# EAGLE design Arduino Nano-Rev3.2 (EAGLE 7.3.0)
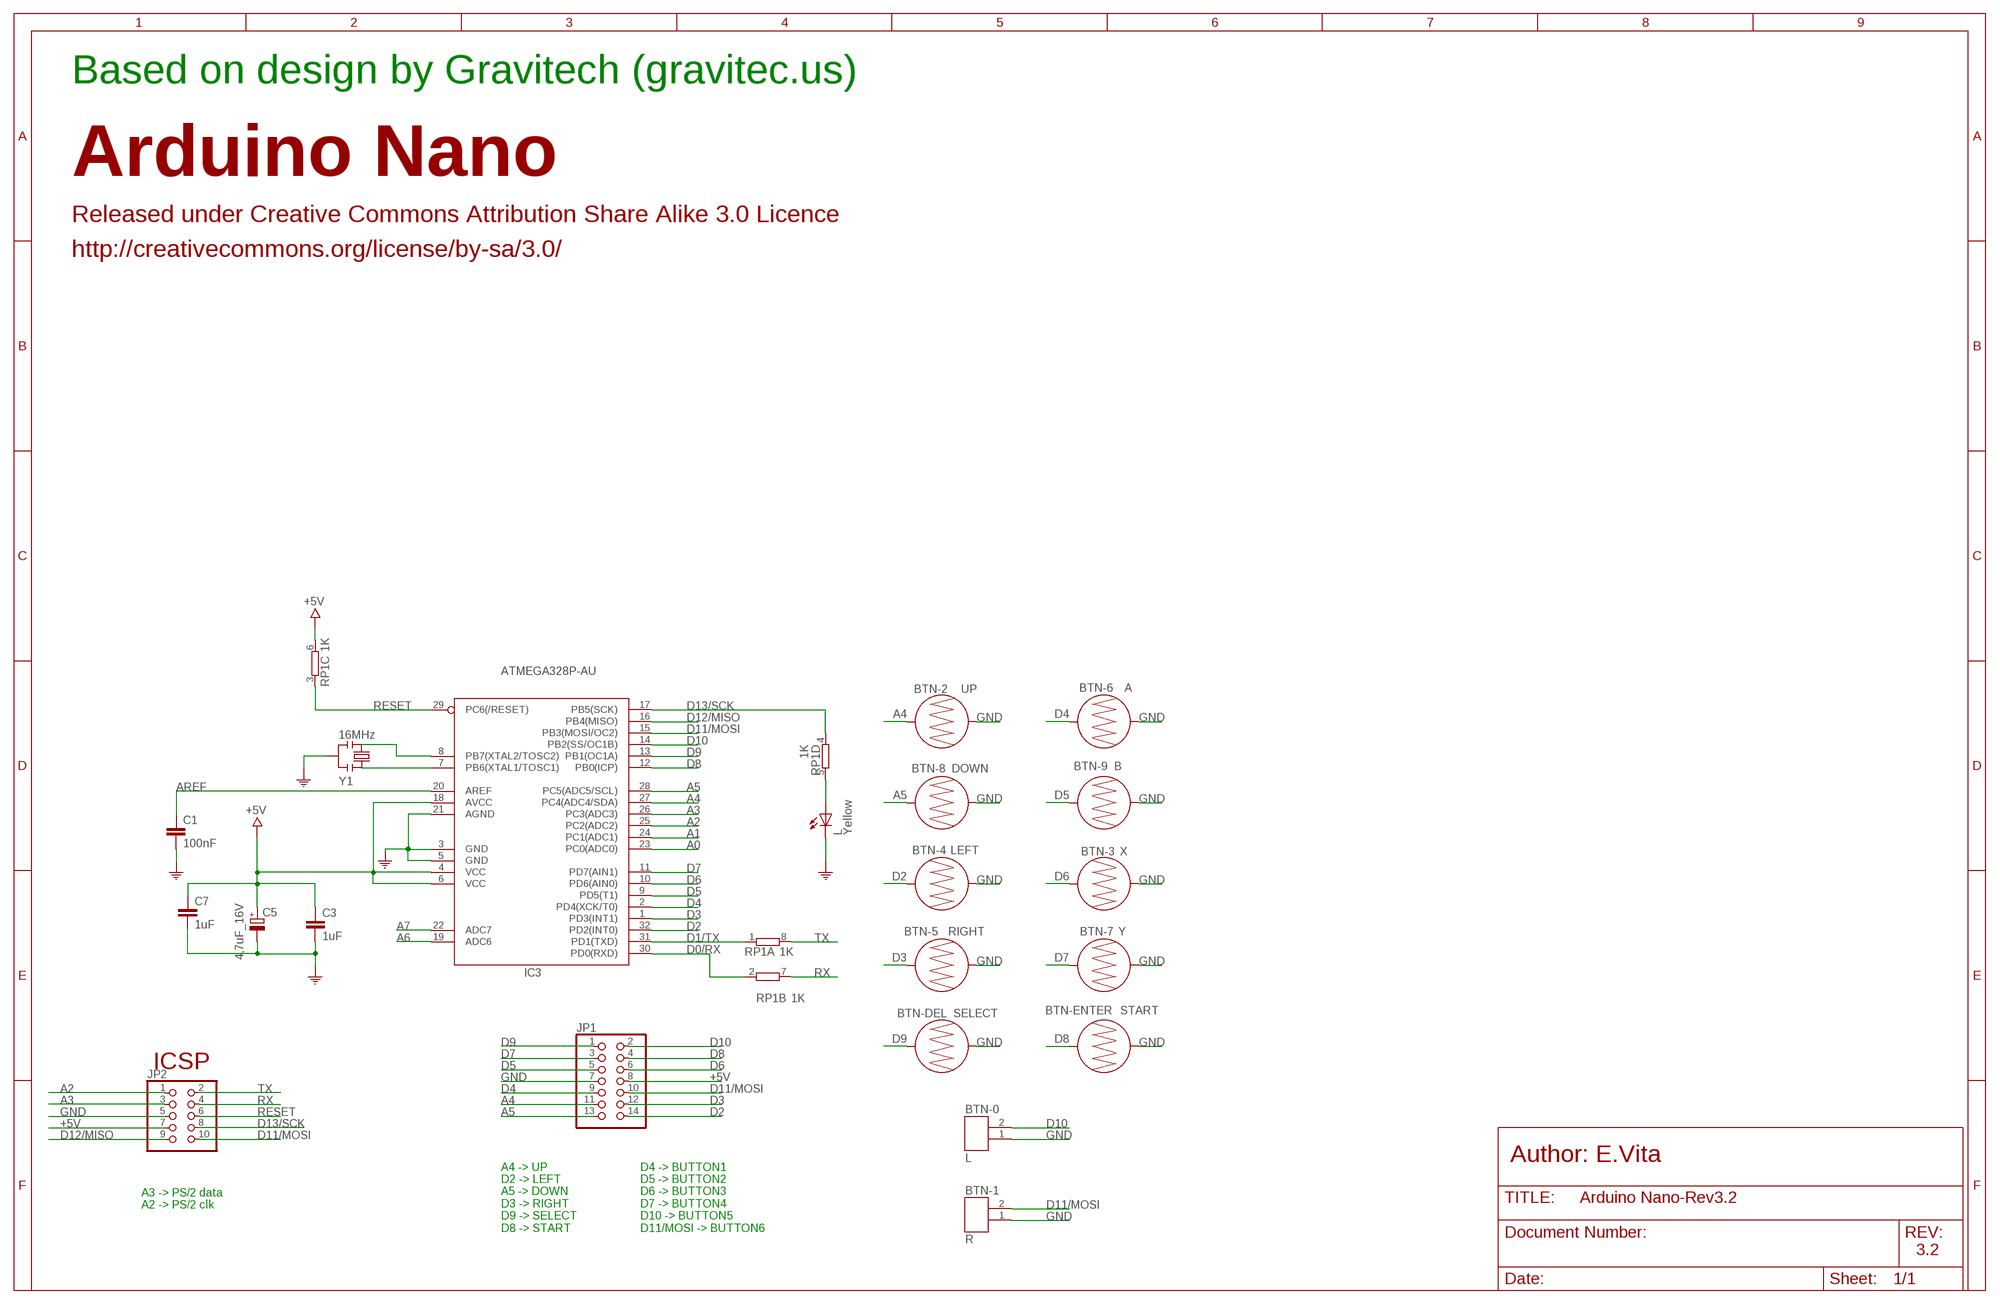
[diagram p0: schematic, sheet 1]

## Parts
BTN-0  L  1X02_SMD  [1X02_SMD]
BTN-1  R  1X02_SMD  [1X02_SMD]
BTN-2  UP  BUTTON-CONDUCTIVE-PAD  [BUTTON-CONDUCTIVE-PAD]
BTN-3  X  BUTTON-CONDUCTIVE-BUTTON  [BUTTON-CONDUCTIVE-BUTTON]
BTN-4  LEFT  BUTTON-CONDUCTIVE-PAD  [BUTTON-CONDUCTIVE-PAD]
BTN-5  RIGHT  BUTTON-CONDUCTIVE-PAD  [BUTTON-CONDUCTIVE-PAD]
BTN-6  A  BUTTON-CONDUCTIVE-BUTTON  [BUTTON-CONDUCTIVE-BUTTON]
BTN-7  Y  BUTTON-CONDUCTIVE-BUTTON  [BUTTON-CONDUCTIVE-BUTTON]
BTN-8  DOWN  BUTTON-CONDUCTIVE-PAD  [BUTTON-CONDUCTIVE-PAD]
BTN-9  B  BUTTON-CONDUCTIVE-BUTTON  [BUTTON-CONDUCTIVE-BUTTON]
BTN-DEL  SELECT  BUTTON-CONDUCTIVE-BUTTON  [BUTTON-CONDUCTIVE-BUTTON]
BTN-ENTER  START  BUTTON-CONDUCTIVE-BUTTON  [BUTTON-CONDUCTIVE-BUTTON]
C1  100nF  0015_100NF_0603  [C0603-ROUND]
C3  1uF  0006_1UF_0603/GRM188R61E105KA12D  [C0603-ROUND]
C5  4,7uF_16V  0833_TAJA475MO16RNJ  [TAN-A]
C7  1uF  0006_1UF_0603/GRM188R61E105KA12D  [C0603-ROUND]
IC3  ATMEGA328P-AU  0265_ATMEGA328P-AU  [TQFP32-08]
JP1  PINHD-2X7  [2X07]
JP2  PINHD-2X5  [2X05]
L  Yellow  0044_KPT-2012YC  [CHIPLED_0805]
RP1  1K  0005_064R_1K_/_CAY16-102J4LF  [CAY16]
Y1  16MHz  0011_CSTCE16M0V53-R0  [RESONATOR]

## Nets
+5V: C3.1 C5.1(+) C7.1 IC3.4(VCC) IC3.6(VCC) IC3.18(AVCC) JP1.8 JP2.7 RP1.6
A0: IC3.23(PC0(ADC0))
A1: IC3.24(PC1(ADC1))
A2: IC3.25(PC2(ADC2)) JP2.1
A3: IC3.26(PC3(ADC3)) JP2.3
A4: BTN-2.1 IC3.27(PC4(ADC4/SDA)) JP1.11
A5: BTN-8.1 IC3.28(PC5(ADC5/SCL)) JP1.13
A6: IC3.19(ADC6)
A7: IC3.22(ADC7)
AREF: C1.1 IC3.20(AREF)
D0/RX: IC3.30(PD0(RXD)) RP1.2
D1/TX: IC3.31(PD1(TXD)) RP1.1
D2: BTN-4.2 IC3.32(PD2(INT0)) JP1.14
D3: BTN-5.1 IC3.1(PD3(INT1)) JP1.12
D4: BTN-6.1 IC3.2(PD4(XCK/T0)) JP1.9
D5: BTN-9.1 IC3.9(PD5(T1)) JP1.5
D6: BTN-3.2 IC3.10(PD6(AIN0)) JP1.6
D7: BTN-7.1 IC3.11(PD7(AIN1)) JP1.3
D8: BTN-ENTER.2 IC3.12(PB0(ICP)) JP1.4
D9: BTN-DEL.1 IC3.13(PB1(OC1A)) JP1.1
D10: BTN-0.2 IC3.14(PB2(SS/OC1B)) JP1.2
D11/MOSI: BTN-1.2 IC3.15(PB3(MOSI/OC2)) JP1.10 JP2.10
D12/MISO: IC3.16(PB4(MISO)) JP2.9
D13/SCK: IC3.17(PB5(SCK)) JP2.8 RP1.4
GND: BTN-0.1 BTN-1.1 BTN-2.2 BTN-3.1 BTN-4.1 BTN-5.2 BTN-6.2 BTN-7.2 BTN-8.2 BTN-9.2 BTN-DEL.2 BTN-ENTER.1 C1.2 C3.2 C5.2(-) C7.2 IC3.3(GND) IC3.5(GND) IC3.21(AGND) JP1.7 JP2.5 L.C Y1.2 ; supply symbol labelled COM
N$1: IC3.8(PB7(XTAL2/TOSC2)) Y1.3
N$2: IC3.7(PB6(XTAL1/TOSC1)) Y1.1
N$7: L.A RP1.5
RESET: IC3.29(PC6(/RESET)) JP2.6 RP1.3
RX: JP2.4 RP1.7
TX: JP2.2 RP1.8

## Notes on the sheet
- Based on design by Gravitech (gravitec.us)
- Arduino Nano
- Released under Creative Commons Attribution Share Alike 3.0 Licence
- http://creativecommons.org/license/by-sa/3.0/
- ICSP
- Author: E.Vita
- A3 -> PS/2 data
  A2 -> PS/2 clk
- A4 -> UP
  D2 -> LEFT
  A5 -> DOWN
  D3 -> RIGHT
  D9 -> SELECT
  D8 -> START
- D4 -> BUTTON1
  D5 -> BUTTON2
  D6 -> BUTTON3
  D7 -> BUTTON4
  D10 -> BUTTON5
  D11/MOSI -> BUTTON6
- 3.2

## Library data of the parts
BTN-0 BTN-1 = ,giltesa:1X02_SMD
BTN-2 BTN-4 BTN-5 BTN-8 = ,giltesa:BUTTON-CONDUCTIVE-PAD
BTN-3 BTN-6 BTN-7 BTN-9 BTN-DEL BTN-ENTER = ,giltesa:BUTTON-CONDUCTIVE-BUTTON
C1 = Condensatori:0015_100NF_0603: 100nF 0603 50V; CASE: 0603; MONTHLY_USAGE: _____; PART_NUMBER: cl10b104kbnc; PRICE: _____; SUPPLIER: _____; TYPE: Condensatori
C3 C7 = Condensatori:0006_1UF_0603/GRM188R61E105KA12D: 1uF 0603; CASE: 0603; MONTHLY_USAGE: _____; PART_NUMBER: 1uF_0603/GRM188R61E105KA12D; PRICE: _____; SUPPLIER: _____; TYPE: Condensatori
C5 = Condensatori:0833_TAJA475MO16RNJ: 4,7uF; CASE: Case_A_(1206); MONTHLY_USAGE: _____; PART_NUMBER: TAJA475MO16RNJ; PRICE: _____; SUPPLIER: _____; TYPE: Condensatori
IC3 = IntegratedCircuits:0265_ATMEGA328P-AU: 8-bit Microcontroller with 32KBytes In-System Programmable Flash ATMEGA328P-AU; CASE: TQFP32_7x7; MONTHLY_USAGE: _____; PART_NUMBER: ATMEGA328P-AU; PRICE: _____; SUPPLIER: _____; TYPE: Circuito_Integrato
JP1 = pinhead:PINHD-2X7: PIN HEADER
JP2 = pinhead:PINHD-2X5: PIN HEADER
L = Opto:0044_KPT-2012YC: LED YELLOW - SMD - 0805; MONTHLY_USAGE: _____; PART_NUMBER: KPT-2012YC; PRICE: _____; SUPPLIER: _____; TYPE: Opto
RP1 = Resistenze:0005_064R_1K_/_CAY16-102J4LF: 1K 064R; CASE: SMD_3,2x1,6; MONTHLY_USAGE: _____; PART_NUMBER: 064R_1K_/_CAY16-102J4LF; PRICE: _____; SUPPLIER: _____; TYPE: Resistenze
Y1 = Cristalli:0011_CSTCE16M0V53-R0: 16Mhz - SMD; MONTHLY_USAGE: _____; PART_NUMBER: CSTCE16M0V53-R0; PRICE: _____; SUPPLIER: _____; TYPE: Cristalli; VALUE: CSTCE16M0V53-R0

## Board
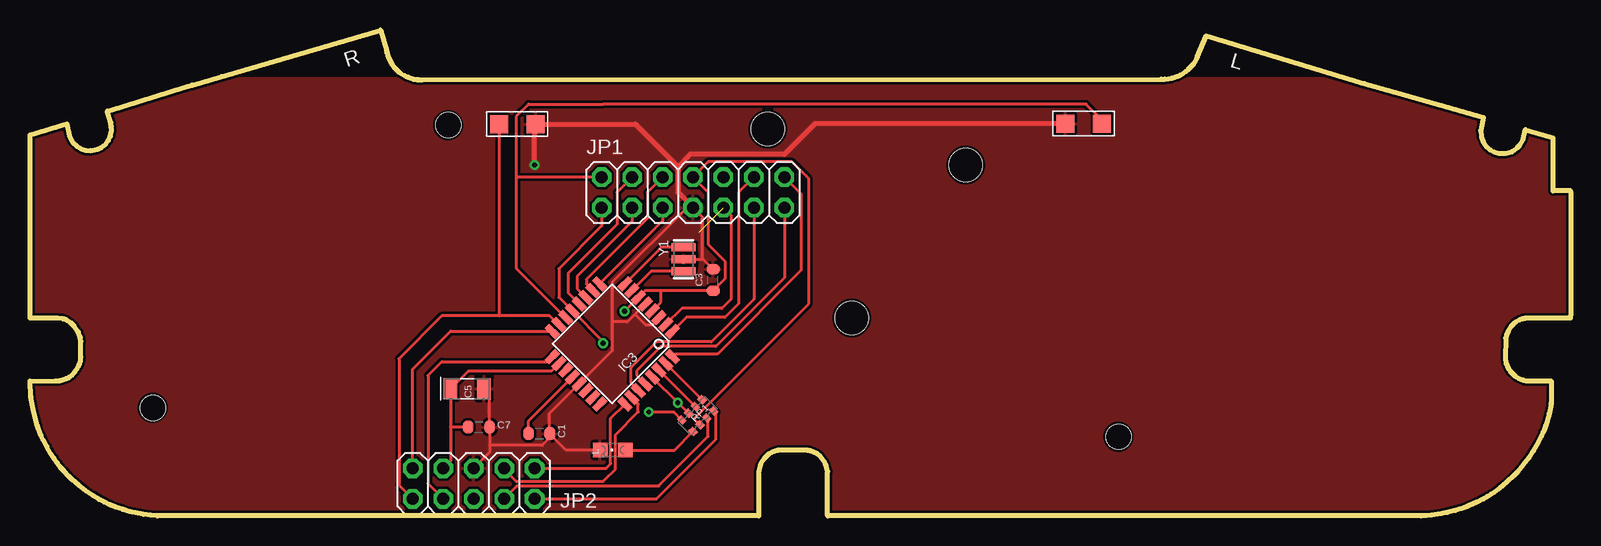
[diagram p1: board, top side]
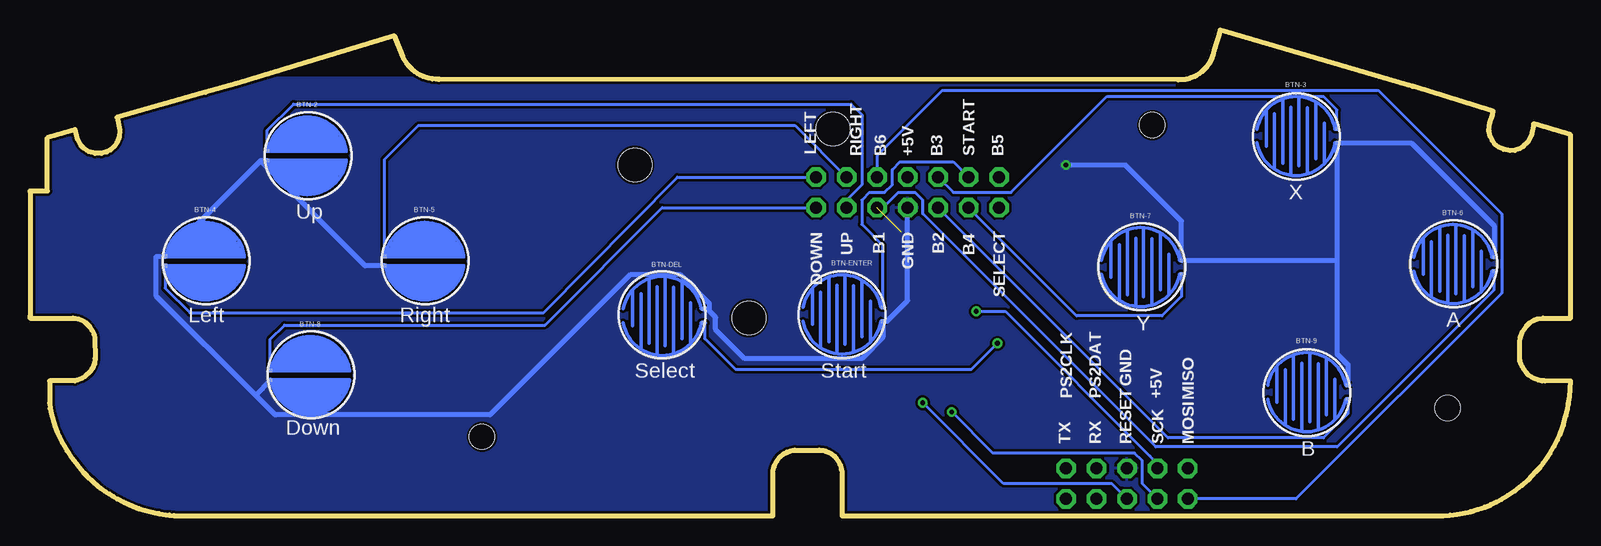
[diagram p2: board, bottom side, seen from below]

Size 128.42 x 40.49 mm. Coordinates in mm from the lower left corner, seen from the top.
Outline: 94.34,36.37 32.72,36.32 32.36,36.35 32.26,36.35 32.08,36.37 31.95,36.4 31.78,36.45 31.52,36.55 31.32,36.63 31.19,36.7 30.91,36.88 30.78,36.98 30.63,37.11 30.43,37.31 30.33,37.44 30.2,37.62 30.12,37.72 29.9,38.18 29.82,38.38 29.77,38.58 29.72,38.76 29.21,40.49 15.95,36.6 13.51,35.89 13.16,35.79 6.45,33.73 6.5,33.45 6.73,32.77 6.78,32.46 6.81,32.11 6.71,31.62 6.53,31.29 6.3,30.96 5.99,30.73 5.59,30.53 5.03,30.43 4.65,30.45 4.22,30.61 3.94,30.78 3.56,31.14 3.28,31.67 3.07,32.66 0,31.75 0,16.48 2.31,16.48 2.77,16.41 3.07,16.28 3.4,16.08 3.66,15.85 4.04,15.32 4.17,14.96 4.19,14.86 4.24,14.53 4.24,13.23 4.22,12.93 4.11,12.6 4.04,12.45 3.91,12.22 3.73,11.99 3.51,11.73 3.25,11.56 3,11.43 2.72,11.33 2.49,11.28 2.36,11.25 2.13,11.25 0,11.23 0.08,9.93 0.18,9.3 0.25,8.86 0.38,8.33 0.61,7.54 0.91,6.73 1.09,6.32 1.4,5.77 1.73,5.18 1.98,4.8 2.29,4.39 2.54,4.06 2.84,3.71 3.23,3.3 3.51,3.02 4.06,2.54 4.65,2.08 5.26,1.68 5.77,1.37 6.17,1.17 6.65,0.94 7.16,0.74 7.72,0.53 8.33,0.36 9.45,0.13 10.06,0.05 10.64,0 60.73,0 60.73,3.63 60.78,3.86 60.86,4.17 60.91,4.29 60.99,4.47 61.19,4.75 61.42,5 61.62,5.16 61.85,5.28 62.1,5.38 62.33,5.46 62.64,5.49 64.67,5.49 64.85,5.46 65.02,5.41 65.33,5.31 65.61,5.16 65.89,4.93 66.19,4.55 66.32,4.29 66.4,4.09 66.5,3.71 66.5,0 115.98,0 116.43,0.03 116.81,0.05 117.65,0.18 118.19,0.28 118.85,0.46 119.33,0.61 119.84,0.79 120.29,0.99 120.62,1.14 121.16,1.42 121.46,1.6 121.79,1.8 122.07,1.98 122.53,2.31 122.78,2.51 123.16,2.84 123.67,3.33 123.98,3.63 124.94,4.83 125.32,5.41 125.7,6.07 125.98,6.63 126.14,6.99 126.34,7.52 126.64,8.51 126.75,8.94 126.8,9.4 126.8,11.25 124.69,11.25 124.49,11.3 124.05,11.48 123.83,11.63 123.42,11.99 123.24,12.27 123.04,12.78 122.99,13.13 123.01,14.81 123.09,15.11 123.24,15.44 123.44,15.77 123.65,15.98 123.88,16.15 124.18,16.33 124.41,16.41 124.61,16.46 124.84,16.48 128.42,16.48
Outline: 94.28,36.4 94.59,36.4 94.87,36.42 95.17,36.47 95.45,36.55 95.66,36.63 95.89,36.73 96.14,36.88 96.37,37.03 96.57,37.21 96.75,37.36 96.9,37.54 97,37.67 97.26,38.07 97.33,38.25 98.04,40.01 111.25,36.02 113.82,35.28 121.16,33.2 120.93,32.13 120.98,31.57 121.16,31.14 121.41,30.76 121.72,30.51 122.02,30.33 122.45,30.2 122.99,30.2 123.55,30.35 123.98,30.66 124.18,30.89 124.46,31.37 124.66,32.18 126.97,31.5 126.97,27.08 128.42,27.08
Outline: 128.42,27.03 128.42,16.66
Copper layers (1*16): Top 0.035mm / dielectric 1.5mm / Bottom 0.035mm
Design rules "default *": minimum track width 10mil, minimum drill 16mil, track to track 8mil, track to pad 8mil, pad to pad 8mil, via to via 8mil, smd to smd 8mil, copper to edge 8mil, drill to drill 8mil, minimum pad ring 12mil, minimum via ring 8mil, stop-mask expansion 0mil, vias tented up to drill 24mil, thermal gap 10mil
Holes 2.8 mm at 61.5,32.24 78,29.24 68.5,16.49
Holes 2.1 mm at 10.25,8.99 90.75,6.59 34.87,32.57

### Footprints (pad centres in the part's own frame; a part is rotated, then mirrored left to right if it is on the bottom)
1X02_SMD = smd 1.5 x 1.5: 1 -1.48,0.02; 2 1.58,0.02
BUTTON-CONDUCTIVE-PAD = smd 0.305 x 0.305: 1 -3.334,0.396; 2 -3.334,-0.396
BUTTON-CONDUCTIVE-BUTTON = smd 0.305 x 0.305: 1 3.41,-0.577; 2 3.412,0.577
C0603-ROUND = smd 0.898 x 1.1: 1 -0.889,0; 2 0.889,0
TAN-A = smd 1.118 x 1.778: 1 0,0; 2 2.794,0
TQFP32-08 = smd 1.27 x 0.559: 1 -4.293,2.8; 2 -4.293,2; 3 -4.293,1.2; 4 -4.293,0.4; 5 -4.293,-0.4; 6 -4.293,-1.2; 7 -4.293,-2; 8 -4.293,-2.8; 17 4.293,-2.8; 18 4.293,-2; 19 4.293,-1.2; 20 4.293,-0.4; 21 4.293,0.4; 22 4.293,1.2; 23 4.293,2; 24 4.293,2.8 | smd 0.559 x 1.27: 9 -2.8,-4.293; 10 -2,-4.293; 11 -1.2,-4.293; 12 -0.4,-4.293; 13 0.4,-4.293; 14 1.2,-4.293; 15 2,-4.293; 16 2.8,-4.293; 25 2.8,4.293; 26 2,4.293; 27 1.2,4.293; 28 0.4,4.293; 29 -0.4,4.293; 30 -1.2,4.293; 31 -2,4.293; 32 -2.8,4.293
2X07 = drill 1.016 octagon: 1 -7.62,-1.27; 2 -7.62,1.27; 3 -5.08,-1.27; 4 -5.08,1.27; 5 -2.54,-1.27; 6 -2.54,1.27; 7 0,-1.27; 8 0,1.27; 9 2.54,-1.27; 10 2.54,1.27; 11 5.08,-1.27; 12 5.08,1.27; 13 7.62,-1.27; 14 7.62,1.27
2X05 = drill 1.016 octagon: 1 -5.08,-1.27; 2 -5.08,1.27; 3 -2.54,-1.27; 4 -2.54,1.27; 5 0,-1.27; 6 0,1.27; 7 2.54,-1.27; 8 2.54,1.27; 9 5.08,-1.27; 10 5.08,1.27
CHIPLED_0805 = smd 1.2 x 1.2: A 0,-1.05; C 0,1.05
CAY16 = smd 0.5 x 0.65: 1 -1.2,-0.675; 2 -0.4,-0.675; 3 0.4,-0.675; 4 1.2,-0.675; 5 1.2,0.675; 6 0.4,0.675; 7 -0.4,0.675; 8 -1.2,0.675
RESONATOR = smd 0.7 x 2: 1 -1,0; 2 0,0; 3 1,0

### Placement (x,y rotation side)
BTN-0  87.78,32.66 0 top
BTN-1  40.67,32.66 180 top
BTN-2  105.31,30 0 bottom
BTN-3  22.89,31.65 0 bottom
BTN-4  113.82,21.23 0 bottom
BTN-5  95.53,21.23 0 bottom
BTN-6  9.8,20.98 0 bottom
BTN-7  35.84,20.73 0 bottom
BTN-8  105.05,11.71 0 bottom
BTN-9  22,10.31 0 bottom
BTN-DEL  75.72,16.66 0 bottom
BTN-ENTER  60.73,16.79 0 bottom
C1  42.44,6.86 0 top
C3  56.95,19.66 90 top
C5  35.05,10.59 0 top
C7  37.41,7.39 0 top
IC3  48.54,14.33 225 top
JP1  55.27,26.95 0 top
JP2  36.98,2.69 180 top
L  48.59,5.49 90 top
RP1  55.65,8.36 225 top
Y1  54.48,21.39 90 top

### Tracks (layer width: path | path; a pad name or v marks a point on that pad's centre or on a via)
+5V  (via drill 0.4)
  Top 0.254: 52.6,18.77 C3.1 57.94,19.76 57.94,21.23 56.54,22.63 56.54,26.95 JP1.8 56.54,29.49 63.53,29.49 64.92,28.09 64.92,17.68 55.4,8.15 55.4,8.03 55.83,7.6 RP1.6 | 52.6,18.77 51.29,18.77 IC3.6 v49.56,17.04 | IC3.4 51.88,17.08 52.6,17.81 52.6,18.77 | IC3.18 43.48,12.09 36.55,12.09 C5.1 35.05,7.39 | 35.05,7.39 35.05,4.57 JP2.7 | C7.1 35.05,7.39
  Bottom 0.254: v49.56,17.04 47.12,17.04 35.05,4.98 35.05,4.95 34.44,4.34 JP2.7
A2
  Top 0.254: JP2.1 48.03,3.96 48.41,4.34 48.41,8.13 IC3.25
A3
  Top 0.254: IC3.26 50.7,9.34 50.7,8.66 48.79,6.76 48.79,3.9 47.78,2.88 40.54,2.88 39.52,3.9 JP2.3
A4
  Top 0.254: JP1.11 60.35,18.06 56.79,14.5 52.22,14.5 50.06,12.34 50.06,11.1 IC3.27
  Bottom 0.254: BTN-2.1 108.64,32.12 106.45,34.32 59.97,34.32 59.08,33.43 59.08,27.58 60.35,26.31 JP1.11
A5
  Top 0.254: JP1.13 62.89,19.84 57.18,14.12 52.6,14.12 50.57,12.09 50.57,11.73 IC3.28
  Bottom 0.254: BTN-8.1 108.39,14.73 107.21,15.9 85.5,15.9 75.72,25.68 JP1.13
AREF
  Top 0.254: C1.1 41.55,7.91 IC3.20
D0/RX
  Top 0.254: RP1.2 55.45,9.12 IC3.30
D1/TX
  Top 0.254: RP1.1 56.01,9.68 IC3.31
D2
  Top 0.254: JP1.14 64.29,26.82 64.29,20.47 57.3,13.49 53.77,13.49 IC3.32
  Bottom 0.254: BTN-4.2 117.15,18.98 115.09,16.92 85.62,16.92 74.45,28.22 JP1.14
D3
  Top 0.254: JP1.12 59.08,26.95 59.08,17.68 57.94,16.54 54.71,16.54 IC3.1
  Bottom 0.254: BTN-5.1 98.86,29.71 96.04,32.54 64.67,32.54 JP1.12
D4  (1 unrouted)
  Top 0.254: JP1.9 58.45,25.04 58.45,18.06 57.68,17.3 54.34,17.3 IC3.2
  Bottom 0.254: BTN-6.1 6.39,18.8 19.46,5.74 34.57,5.74 54,25.17 54,26.31 54.64,26.95 56.03,26.95 57.3,25.68 JP1.9
D5
  Top 0.254: JP1.5 52.73,24.59 IC3.9
  Bottom 0.254: BTN-9.1 18.59,8.52 20.6,6.5 33.55,6.5 JP1.5
D6
  Top 0.254: JP1.6 51.46,26.95 51.46,24.79 46.38,19.71 46.38,19.31 IC3.10
  Bottom 0.254: BTN-3.2 19.47,33.82 20.6,34.95 38.63,34.95 46.63,26.95 51.46,26.95 JP1.6
D7
  Top 0.254: JP1.3 50.19,24.54 45.62,19.96 45.62,18.94 IC3.11
  Bottom 0.254: BTN-7.1 32.43,18.29 34.06,16.66 41.17,16.66 JP1.3
D8
  Top 0.254: JP1.4 48.92,26.95 48.92,24.28 44.86,20.22 44.86,18.57 IC3.12
  Bottom 0.254: BTN-ENTER.2 57.32,22.52 59.08,24.28 59.08,26.31 58.45,26.95 57.18,26.95 56.54,27.58 56.54,28.85 55.91,29.49 51.46,29.49 JP1.4
D9  (via drill 0.4)
  Top 0.254: JP1.1 47.65,24.16 44.09,20.6 44.09,18.21 IC3.13 47.78,14.52 v47.78,14.38
  Bottom 0.254: 72.09,16.09 BTN-DEL.1 72.16,15.94 72.16,14.76 69.62,12.22 49.94,12.22 v47.78,14.38
D10
  Top 0.254: 44.63,16.51 IC3.14 40.54,20.63 40.54,28.22 | BTN-0.2 89.36,32.99 88.04,34.32 47.9,34.32 47.78,34.32 41.55,34.32 40.54,33.3 40.54,28.22 | JP1.2 40.54,28.22
D11/MOSI
  Top 0.254: IC3.15 44.05,15.95 43.33,16.66 39.14,16.66 | 39.14,16.66 34.32,16.66 30.76,13.11 30.76,2.57 JP2.10 | BTN-1.2 39.09,16.72 39.14,16.66
  Bottom 0.254: JP2.10 22.89,1.42 5.74,18.57 5.74,25.17 16.03,35.46 52.35,35.46 57.81,30 JP1.10
D12/MISO
  Top 0.254: IC3.16 43.51,15.39 35.08,15.39 31.9,12.22 JP2.9
D13/SCK  (via drill 0.4)
  Top 0.254: IC3.17 43.11,12.85 34.32,12.85 33.17,11.71 33.17,2.69 JP2.8 | v51.59,8.66 53.65,8.66 RP1.4
  Bottom 0.254: JP2.8 35.71,2.69 35.71,4.6 36.35,5.23 48.16,5.23 v51.59,8.66
GND  (via drill 0.4)
  Top 0.254: C1.2 43.33,8.55 IC3.21 48.54,13.76 48.54,16.15 | C5.2 38.3,10.13 C7.2 38.3,5.87 | Y1.2 56.03,21.39 | 56.03,21.39 56.11,21.39 C3.2 | 56.03,21.39 56.03,24.92 JP1.7 54.76,25.68 48.54,19.46 48.54,16.15 | L.C 44.7,5.49 C1.2 | 38.3,5.87 38.3,5.28 JP2.5 | C1.2 43.33,6.5 42.7,5.87 38.3,5.87 | IC3.3 52.42,16.48 51.84,15.9 51.33,15.9 50.44,16.79 | IC3.5 50.44,16.79 | 50.44,16.79 49.81,16.15 48.54,16.15
  Top 0.406: 54,29.11 50.46,32.64 BTN-1.1 42.06,31.42 v42.06,29.24 | 54,29.11 54,26.95 JP1.7 | BTN-0.1 65.45,32.68 62.89,30.12 55.02,30.12 54,29.11
  Bottom 0.406: BTN-2.2 109.18,29.6 109.21,29.58 | 109.21,29.58 BTN-4.1 117.17,21.62 117.88,21.62 117.88,18.31 109.63,10.06 | BTN-5.2 100.47,20.84 109.21,29.58 | 109.63,10.06 107.98,8.41 90.07,8.41 78.38,20.09 74.19,20.09 71.78,17.68 71.78,17.17 | BTN-6.2 6.38,21.57 6.38,24.16 13.29,31.07 BTN-3.1 19.48,21.23 | 19.48,21.23 19.48,13.51 18.57,12.6 18.57,10.91 BTN-9.2 | 19.48,21.23 19.54,21.3 BTN-7.2 32.43,24.55 37.11,29.24 v42.06,29.24 | BTN-8.2 108.39,11.3 109.63,10.06 | 71.78,17.17 71.78,17.04 71.27,16.54 71.27,15.52 68.86,13.11 59.08,13.11 57.32,14.87 BTN-ENTER.1 56.99,16.21 55.27,17.93 JP1.7 | BTN-DEL.2 71.85,17.24 71.78,17.17
  pour Bottom: 0.03,36.47 128.3,36.47 128.3,0.03 0.03,0.03
  pour Top: 0.03,36.47 128.3,36.47 128.3,0.03 0.03,0.03
N$1
  Top 0.254: Y1.3 52.64,22.39 IC3.8
N$2
  Top 0.254: Y1.1 51.77,20.39 IC3.7
N$7
  Top 0.254: L.A 53.74,5.49 RP1.5
RESET  (via drill 0.4)
  Top 0.254: RP1.3 54.02,9.42 v54,9.42 IC3.29
  Bottom 0.254: JP2.6 38.25,2.69 47.27,2.69 v54,9.42
RX
  Top 0.254: JP2.4 40.6,2.5 52.41,2.5 56.54,6.63 56.54,8.03 RP1.7
TX
  Top 0.254: JP2.2 52.22,1.42 57.18,6.38 57.18,8.53 RP1.8

### Text on the board
tPlace: L | R
bPlace: B5 | START | B3 | +5V | B6 | RIGHT | LEFT | X | Up | SELECT | B2 | GND | B1 | UP | DOWN | B4 | A | Right | Left | Y | GND | Start | Select | MISO | +5V | PS2DAT | PS2CLK | Down | MOSI | SCK | RESET | RX | TX | B